# EAGLE design DIY-Arduino-v0.1 (EAGLE 9.2.0)
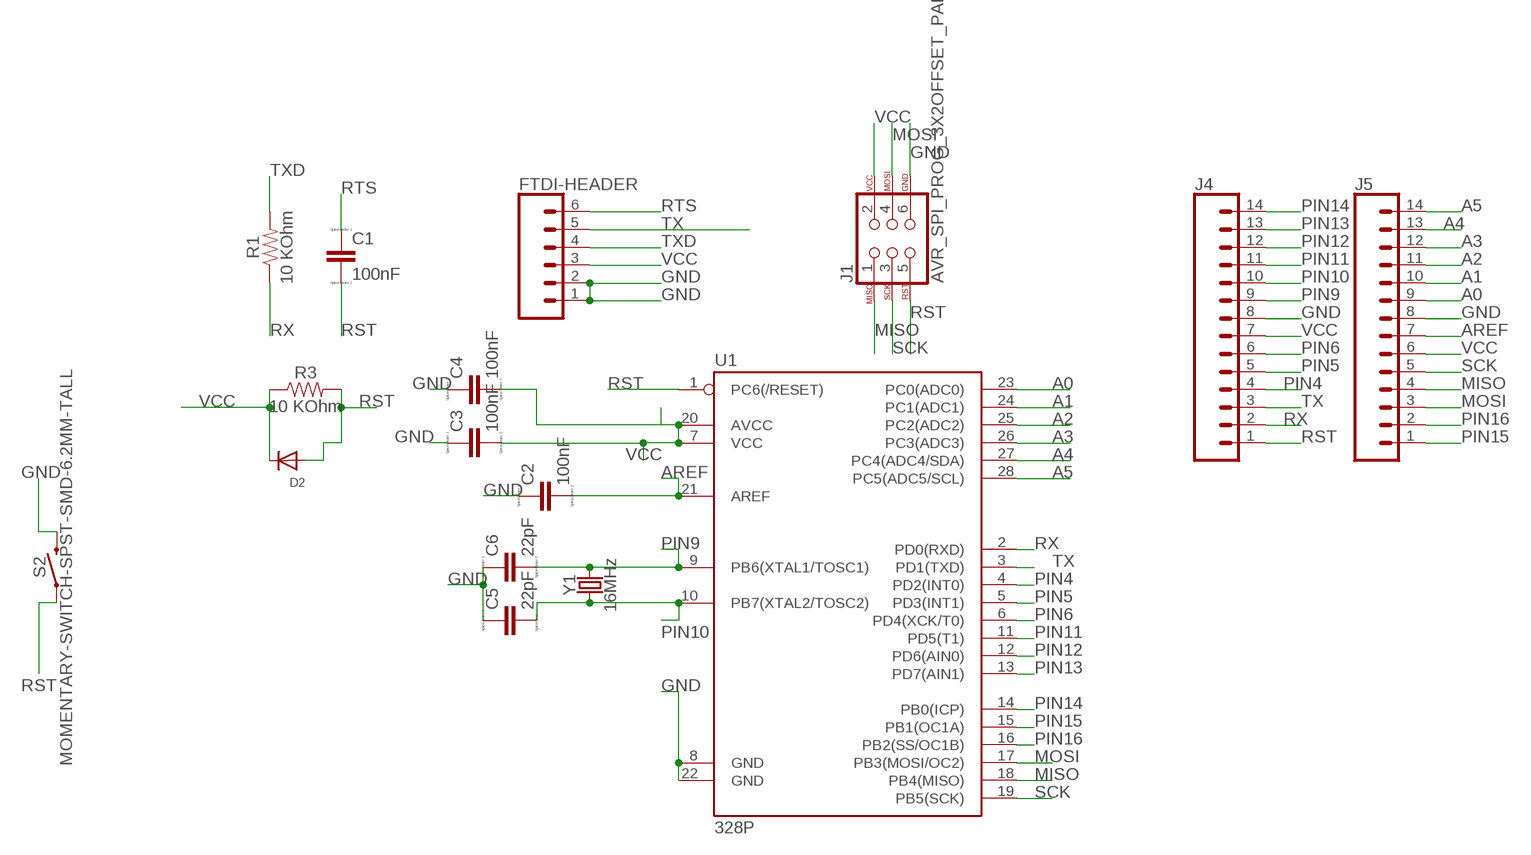
[diagram p0: schematic, sheet 1]

## Parts
C1  100nF  CC1206  [C1206]
C2  100nF  CC1206  [C1206]
C3  100nF  CC1206  [C1206]
C4  100nF  CC1206  [C1206]
C5  22pF  CC1206  [C1206]
C6  22pF  CC1206  [C1206]
D2  DIODEDO-1N4148  [DO-1N4148]
FTDI-HEADER  CONN_06NO_SILK_FEMALE_PTH  [1X06_NO_SILK]
J1  AVR_SPI_PROG_3X2OFFSET_PADS  [2X3_OFFSET]
J4  CONN_14NO_SILK  [1X14_NO_SILK]
J5  CONN_14NO_SILK  [1X14_NO_SILK]
R1  10 KOhm  RESISTOR1206  [1206]
R3  10 KOhm  RESISTOR1206  [1206]
S2  MOMENTARY-SWITCH-SPST-SMD-6.2MM-TALL  [TACTILE_SWITCH_SMD_6.2MM_TALL]
U1  328P  ATMEGA328P_PDIP  [DIP28]
Y1  16MHz  CRYSTAL-16MHZPTH-HC49US  [HC49US]

## Nets
A0: J5.9 U1.23(PC0(ADC0))
A1: J5.10 U1.24(PC1(ADC1))
A2: J5.11 U1.25(PC2(ADC2))
A3: J5.12 U1.26(PC3(ADC3))
A4: J5.13 U1.27(PC4(ADC4/SDA))
A5: J5.14 U1.28(PC5(ADC5/SCL))
AREF: C2.2 J5.7 U1.21(AREF)
GND: C2.1 C3.1 C4.1 C5.1 C6.1 FTDI-HEADER.1 FTDI-HEADER.2 J1.6 J4.8 J5.8 S2.B2 U1.8(GND) U1.22(GND)
MISO: J1.1 J5.4 U1.18(PB4(MISO))
MOSI: J1.4 J5.3 U1.17(PB3(MOSI/OC2))
PIN4: J4.4 U1.4(PD2(INT0))
PIN5: J4.5 U1.5(PD3(INT1))
PIN6: J4.6 U1.6(PD4(XCK/T0))
PIN9: C6.2 J4.9 U1.9(PB6(XTAL1/TOSC1)) Y1.2
PIN10: C5.2 J4.10 U1.10(PB7(XTAL2/TOSC2)) Y1.1
PIN11: J4.11 U1.11(PD5(T1))
PIN12: J4.12 U1.12(PD6(AIN0))
PIN13: J4.13 U1.13(PD7(AIN1))
PIN14: J4.14 U1.14(PB0(ICP))
PIN15: J5.1 U1.15(PB1(OC1A))
PIN16: J5.2 U1.16(PB2(SS/OC1B))
RST: C1.2 D2.A J1.5 J4.1 R3.2 S2.A2 U1.1(PC6(/RESET))
RTS: C1.1 FTDI-HEADER.6
RX: J4.2 R1.1 U1.2(PD0(RXD))
SCK: J1.3 J5.5 U1.19(PB5(SCK))
TX: FTDI-HEADER.5 J4.3 U1.3(PD1(TXD))
TXD: FTDI-HEADER.4 R1.2
VCC: C3.2 C4.2 D2.C FTDI-HEADER.3 J1.2 J4.7 J5.6 R3.1 U1.7(VCC) U1.20(AVCC)

## Library data of the parts
C1-C6 = eagle-ltspice:C: CAPACITOR, European symbol; SPICEMODEL: NONE; SPICEPREFIX: C
D2 = adafruit:DIODE: Diode SMADIODE - SMA Surface Mount Package 20V 1A Schottky Diode Digikey: 641-1014-6-ND DO-1N4148 - Through Hole Small Current Diode SOD-123 20V 1 A (.5mV Vf) Schottky Diode - Digikey: MBRX120TPMSCT-ND SOD-323 10V 570mA (.38mV Vf, 3ns) Schottky Diode - Digikey: ZLLS410CT-ND SOD-523 30V 30mA Schottky Diode (RB751S-40TE61) - Digikey: RB751S-40TE61CT-ND SOT23-R/W - SOT23 Package (R = Solder Paste/Reflow Ovens, W = Hand-Soldering) BAT54Film 40V 300mA - Digikey: 497-7162-1-ND
FTDI-HEADER = SparkFun-Connectors:CONN_06: Multi connection point. Often used as Generic Header-pin footprint for 0.1 inch spaced/style header connections On any of the 0.1 inch spaced packages, you can populate with these: Break Away Headers - Straight <https://www.sparkfun.com/products/116> (PRT-00116) Break Away Male Headers - Right Angle <https://www.sparkfun.com/products/553> (PRT-00553) Female Headers <https://www.sparkfun.com/products/115> (PRT-00115) Break Away Headers - Machine Pin <https://www.sparkfun.com/products/117> (PRT-00117) Break Away Female Headers - Swiss Machine Pin <https://www.sparkfun.com/products/743> (PRT-00743) Arduino Stackable Header - 6 Pin <https://www.sparkfun.com/products/9280> (PRT-09280) For SCREWTERMINALS and SPRING TERMINALS visit here: Screw Terimnals on SparkFun.com <https://www.sparkfun.com/search/results?term=Screw+Terminals> (5mm/3.5mm/2.54mm spacing) This device is also useful as a general connection point to wire up your design to another part of your project. Our various solder wires solder well into these plated through hole pads. Hook-Up Wire - Assortment (Stranded, 22 AWG) <https://www.sparkfun.com/products/11375> (PRT-11375) Hook-Up Wire - Assortment (Solid Core, 22 AWG) <https://www.sparkfun.com/products/11367> (PRT-11367) View the entire wire category on our website here <https://www.sparkfun.com/categories/141>; PROD_ID: CONN-08437
J1 = SparkFun-Connectors:AVR_SPI_PROG_3X2: AVR ISP 6 Pin This is the reduced ISP connector for AVR programming. Common on Arduino. This footprint will take up less PCB space and can be used with a 10-pin to 6-pin adapter such as SKU: BOB-08508 **Special note about "TEST_POINT" package. The stop mask is on the top side, so if you want your programming test points to be on the bottom of your board, make sure to place this package on the bottom side of the board. This also ensure that the orientation to program from the bottom side will be correct. SparkFun Products: SparkFun ISP Pogo Adapter <https://www.sparkfun.com/products/11591> - NS Tiny AVR Programmer <https://www.sparkfun.com/products/11801> -PTH
J4 J5 = SparkFun-Connectors:CONN_14: Multi connection point. Often used as Generic Header-pin footprint for 0.1 inch spaced/style header connections On any of the 0.1 inch spaced packages, you can populate with these: Break Away Headers - Straight <https://www.sparkfun.com/products/116> (PRT-00116) Break Away Male Headers - Right Angle <https://www.sparkfun.com/products/553> (PRT-00553) Female Headers <https://www.sparkfun.com/products/115> (PRT-00115) Break Away Headers - Machine Pin <https://www.sparkfun.com/products/117> (PRT-00117) Break Away Female Headers - Swiss Machine Pin <https://www.sparkfun.com/products/743> (PRT-00743) For SCREWTERMINALS and SPRING TERMINALS visit here: Screw Terimnals on SparkFun.com <https://www.sparkfun.com/search/results?term=Screw+Terminals> (5mm/3.5mm/2.54mm spacing) This device is also useful as a general connection point to wire up your design to another part of your project. Our various solder wires solder well into these plated through hole pads. Hook-Up Wire - Assortment (Stranded, 22 AWG) <https://www.sparkfun.com/products/11375> (PRT-11375) Hook-Up Wire - Assortment (Solid Core, 22 AWG) <https://www.sparkfun.com/products/11367> (PRT-11367) View the entire wire category on our website here <https://www.sparkfun.com/categories/141> Special notes: Molex polarized connector foot print use with SKU : PRT-08231 with associated crimp pins and housings. 1MM SMD Version SKU: PRT-10208 NOTES ON THE VARIANTS LOCK and LOCK_LONGPADS... This footprint was designed to help hold the alignment of a through-hole component (i.e. 6-pin header) while soldering it into place. You may notice that each hole has been shifted either up or down by 0.005 of an inch from it's more standard position (which is a perfectly straight line). This slight alteration caused the pins (the squares in the middle) to touch the edges of the holes. Because they are alternating, it causes a "brace" to hold the component in place. 0.005 has proven to be the perfect amount of "off-center" position when using our standard breakaway headers. Although looks a little odd when you look at the bare footprint, once you have a header in there, the alteration is very hard to notice. Also,if you push a header all the way into place, it is covered up entirely on the bottom side.
R1 R3 = SparkFun-Resistors:RESISTOR: Generic Resistor Package
S2 = SparkFun-Switches:MOMENTARY-SWITCH-SPST: Momentary Switch (Pushbutton) - SPST Normally-open (NO) SPST momentary switches (buttons, pushbuttons). Variants PTH-12MM - 12mm square, through-hole Momentary Pushbutton Switch - 12mm Square <https://www.sparkfun.com/products/9190> (COM-09190) PTH-6.0MM, PTH-6.0MM-KIT - 6.0mm square, through-hole Mini Pushbutton Switch <https://www.sparkfun.com/products/97> (COM-00097) KIT package intended for soldering kit's - only one side of pads' copper is exposed. PTH-RIGHT-ANGLE-KIT - Right-angle, through-hole Right Angle Tactile Button <https://www.sparkfun.com/products/10791> - Used on SparkFun BigTime Watch Kit <https://www.sparkfun.com/products/11734> SMD-12MM - 12mm square, surface-mount Tactile Button - SMD (12mm) <https://www.sparkfun.com/products/12993> (COM-12993) Used on SparkFun PicoBoard <https://www.sparkfun.com/products/11888> SMD-4.5MM - 4.5mm Square Trackball Switch Used on SparkFun Blackberry Trackballer Breakout <https://www.sparkfun.com/products/13169> SMD-4.6MMX2.8MM - 4.60mm x 2.80mm, surface mount Used on SparkFun SAMD21 Mini Breakout <https://www.sparkfun.com/products/13664> SMD-5.2MM, SMD-5.2-REDUNDANT - 5.2mm square, surface-mount Mini Pushbutton Switch - SMD <https://www.sparkfun.com/products/8720> (COM-08720) Used on Arduino Pro Mini <https://www.sparkfun.com/products/11114> REDUNDANT package connects both switch circuits together SMD-6.0X3.5MM - 6.0 x 3.5mm, surface mount Momentary Reset Switch SMD <https://www.sparkfun.com/products/8229> (COM-08229) SMD-6.2MM-TALL - 6.2mm square, surface mount Tactile Button - SMD (6mm) <https://www.sparkfun.com/products/12992> Used on SparkFun Digital Sandbox <https://www.sparkfun.com/products/12651> SMD-RIGHT-ANGLE - Right-angle, surface mount Used on SparkFun Block for Intel® Edison - Arduino <https://www.sparkfun.com/products/13036>; PROD_ID: SWCH-11966; SF_SKU: COM-12992
U1 = SparkFun-IC-Microcontroller:ATMEGA328P_PDIP: Atmel 328P Through hole ATMEGA328P uC used in the Arduino 32kb flash, 1k EEPROM, 2k SRAM Datasheet <http://www.sparkfun.com/datasheets/Components/SMD/ATMega328.pdf> SparkFun Products Storefront component: AVR 28 Pin 20MHz 32K 6A/D - ATMega328P <https://www.sparkfun.com/products/9061> (COM-09061) SparkFun Simon Says - Through-Hole Soldering Kit <https://www.sparkfun.com/products/10547> (KIT-10547) SparkFun Learn to Solder - Simon Says <https://www.sparkfun.com/products/13708> (KIT-13708) SparkFun BigTime Watch Kit <https://www.sparkfun.com/products/11734> (KIT-11734) SparkFun ClockIt <https://www.sparkfun.com/products/10930> (KIT-10930) SparkFun Serial Enabled LCD Kit <https://www.sparkfun.com/products/10097> (LCD-10097) SparkFun Simon Tilts - Through Hole Soldering Kit <https://www.sparkfun.com/products/12634> (KIT-12634) SparkFun Frequency Counter Kit <https://www.sparkfun.com/products/10140> (KIT-10140) FabFM Radio Kit <https://www.sparkfun.com/products/11043> (KIT-11043) SparkFun Binary Blaster Kit <https://www.sparkfun.com/products/12037> (KIT-12037) SparkFun Metro-Gnome <https://www.sparkfun.com/products/9236> (KIT-09236) ATmega328 with Arduino Optiboot (Uno) <https://www.sparkfun.com/products/10524> (DEV-10524); PROD_ID: IC-09136
Y1 = SparkFun-Clocks:CRYSTAL-16MHZ: 16MHz Crystal Digikey Example <http://www.digikey.com/product-search/en?keywords=535-9122-1-ND> Frequency: 16MHz Frequency Stability: ±50ppm Frequency Tolerance: ±20ppm Load Capacitance: 18pF SparkFun Products: Pro Micro -5V/16MHz <https://www.sparkfun.com/products/12640> SparkFun Serial Enabled LCD Kit <https://www.sparkfun.com/products/10097>; PROD_ID: XTAL-08181; SF_ID: COM-00536

## Board
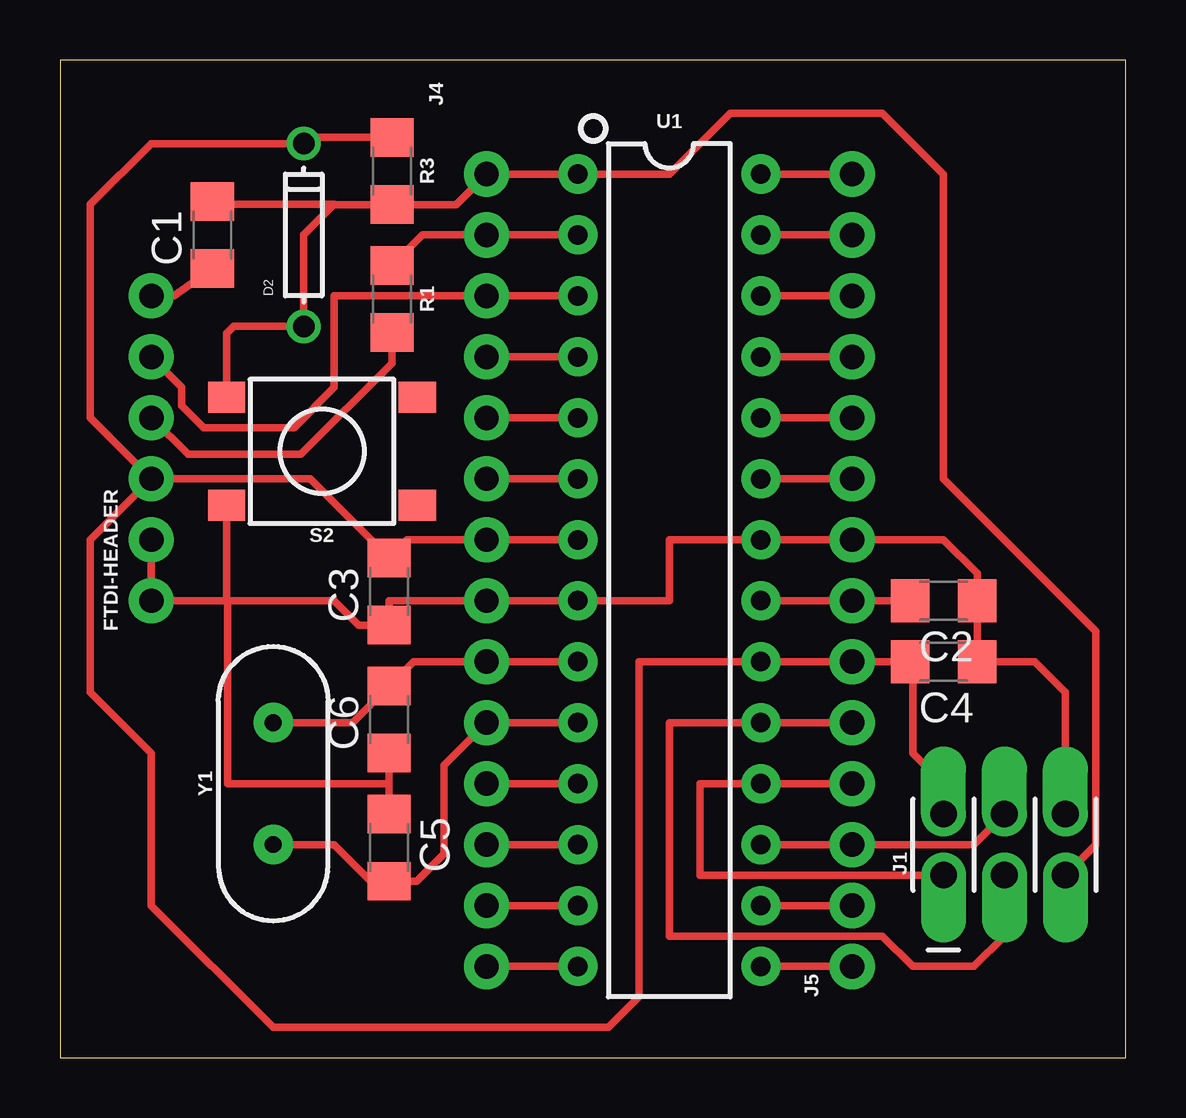
[diagram p1: board, top side]
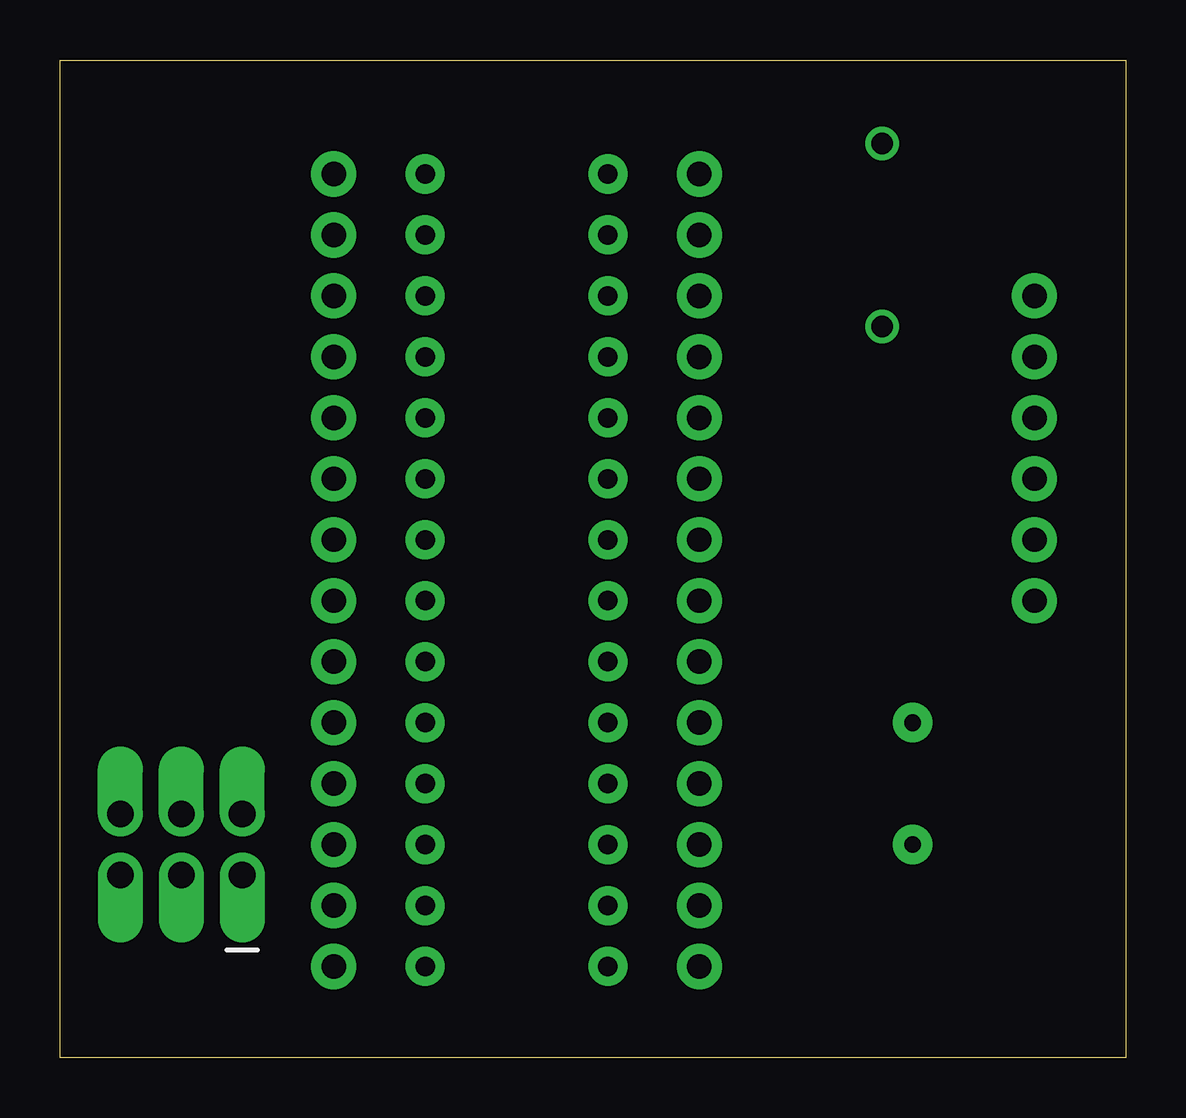
[diagram p2: board, bottom side, seen from below]

Size 44.43 x 41.58 mm. Coordinates in mm from the lower left corner, seen from the top.
Outline: 0,0 44.43,0 44.43,41.58 0,41.58 0,0
Copper layers (1*16): Top 0.035mm / dielectric 1.5mm / Bottom 0.035mm
Design rules "default": minimum track width 6mil, minimum drill 0.35mm, track to track 6mil, track to pad 6mil, pad to pad 6mil, via to via 6mil, smd to smd 6mil, copper to edge 40mil, drill to drill 6mil, minimum pad ring 10mil, minimum via ring 8mil, stop-mask expansion 4mil, vias tented up to drill 0mil, thermal gap 10mil

### Footprints (pad centres in the part's own frame; a part is rotated, then mirrored left to right if it is on the bottom)
C1206 = smd 1.6 x 1.8: 1 -1.4,0; 2 1.4,0
DO-1N4148 = drill 0.9: A -3.81,0; C 3.81,0
1X06_NO_SILK = drill 1.016 pad 1.88: 1 0,0; 2 2.54,0; 3 5.08,0; 4 7.62,0; 5 10.16,0; 6 12.7,0
2X3_OFFSET = drill 1.118 pad 1.88 offset: 1 -2.54,-1.27; 2 -2.54,1.27; 3 0,-1.27; 4 0,1.27; 5 2.54,-1.27; 6 2.54,1.27
1X14_NO_SILK = drill 1.016 pad 1.88: 1 0,0; 2 2.54,0; 3 5.08,0; 4 7.62,0; 5 10.16,0; 6 12.7,0; 7 15.24,0; 8 17.78,0; 9 20.32,0; 10 22.86,0; 11 25.4,0; 12 27.94,0; 13 30.48,0; 14 33.02,0
1206 = smd 1.6 x 1.8: 1 -1.4,0; 2 1.4,0
TACTILE_SWITCH_SMD_6.2MM_TALL = smd 1.55 x 1.3: A1 -3.975,-2.25; A2 3.975,-2.25; B1 -3.975,2.25; B2 3.975,2.25
DIP28 = drill 0.813 pad 1.626: 1 -16.51,-3.81; 2 -13.97,-3.81; 3 -11.43,-3.81; 4 -8.89,-3.81; 5 -6.35,-3.81; 6 -3.81,-3.81; 7 -1.27,-3.81; 8 1.27,-3.81; 9 3.81,-3.81; 10 6.35,-3.81; 11 8.89,-3.81; 12 11.43,-3.81; 13 13.97,-3.81; 14 16.51,-3.81; 15 16.51,3.81; 16 13.97,3.81; 17 11.43,3.81; 18 8.89,3.81; 19 6.35,3.81; 20 3.81,3.81; 21 1.27,3.81; 22 -1.27,3.81; 23 -3.81,3.81; 24 -6.35,3.81; 25 -8.89,3.81; 26 -11.43,3.81; 27 -13.97,3.81; 28 -16.51,3.81
HC49US = drill 0.7 pad 1.651: 1 -2.54,0; 2 2.54,0

### Placement (x,y rotation side)
C1  6.35,34.29 90 top
C2  36.83,19.05 180 top
C3  13.72,19.43 90 top
C4  36.83,16.51 180 top
C5  13.72,8.76 270 top
C6  13.72,14.1 90 top
D2  10.16,34.29 90 top
FTDI-HEADER  3.81,19.05 90 top
J1  39.37,8.89 0 top
J4  17.78,36.83 270 top
J5  33.02,3.81 90 top
R1  13.84,31.62 270 top
R3  13.84,36.96 270 top
S2  10.92,25.27 180 top
U1  25.4,20.32 270 top
Y1  8.89,11.43 90 top

### Tracks (layer width: path | path; a pad name or v marks a point on that pad's centre or on a via)
A0
  Top 0.305: J5.9 U1.23
A1
  Top 0.305: J5.10 U1.24
A2
  Top 0.305: J5.11 U1.25
A3
  Top 0.305: J5.12 U1.26
A4
  Top 0.305: J5.13 U1.27
A5
  Top 0.305: J5.14 U1.28
AREF
  Top 0.305: U1.21 J5.7 C2.2
GND
  Top 0.305: C6.1 13.72,11.43 | 13.72,11.43 C5.1 | 6.73,23.24 S2.B2 6.95,19.05 | 6.99,19.05 11.43,19.05 12.45,18.03 C3.1 13.72,19.05 J4.8 U1.8 25.4,19.05 25.4,21.59 U1.22 J5.8 36.83,21.59 38.23,20.19 C2.1 C4.1 40.64,16.51 41.91,15.24 J1.6 | 6.99,19.05 6.95,19.05 | 6.95,19.05 FTDI-HEADER.1 FTDI-HEADER.2 | 13.72,11.43 6.99,11.43 6.99,19.05
MISO
  Top 0.305: J5.4 U1.18 26.67,11.43 26.67,7.62 J1.1
MOSI
  Top 0.305: U1.17 J5.3 38.1,8.89 J1.4
PIN4
  Top 0.305: U1.4 J4.4
PIN5
  Top 0.305: U1.5 J4.5
PIN6
  Top 0.305: U1.6 J4.6
PIN9
  Top 0.305: Y1.2 12.19,13.97 C6.2 14.73,16.51 J4.9 U1.9
PIN10
  Top 0.305: Y1.1 11.43,8.89 12.96,7.36 C5.2 | C5.2 | U1.10 J4.10 16,12.19 16,8.51 14.86,7.36 C5.2
PIN11
  Top 0.305: U1.11 J4.11
PIN12
  Top 0.305: U1.12 J4.12
PIN13
  Top 0.305: U1.13 J4.13
PIN14
  Top 0.305: U1.14 J4.14
PIN15
  Top 0.305: J5.1 U1.15
PIN16
  Top 0.305: J5.2 U1.16
RST
  Top 0.305: U1.1 | U1.1 J4.1 16.51,35.56 R3.2 11.43,35.56 | U1.1 25.4,36.83 27.94,39.37 34.29,39.37 36.83,36.83 36.83,24.13 43.18,17.78 43.18,8.89 J1.5 | 11.43,35.56 10.16,34.29 D2.A 7.24,30.48 6.95,30.19 S2.A2 | 11.43,35.56 6.48,35.56 C1.2
RTS
  Top 0.305: C1.1 4.77,31.75 FTDI-HEADER.6
RX
  Top 0.305: R1.1 15.11,34.29 J4.2 U1.2
SCK
  Top 0.305: J5.5 U1.19 25.4,13.97 25.4,5.08 34.29,5.08 35.56,3.81 38.1,3.81 39.37,5.08 J1.3
TX
  Top 0.305: U1.3 J4.3 11.43,31.75 11.43,27.94 9.75,26.26 6,26.26 5.08,27.18 5.08,27.94 FTDI-HEADER.5
TXD
  Top 0.305: R1.2 13.84,28.95 10.04,25.15 5.33,25.15 FTDI-HEADER.4
VCC
  Top 0.305: U1.7 J4.7 14.47,21.59 C3.2 10.42,24.13 FTDI-HEADER.3 | R3.1 10.42,38.36 D2.C 3.81,38.1 1.27,35.56 1.27,26.67 FTDI-HEADER.3 | FTDI-HEADER.3 1.27,21.59 1.27,15.24 3.81,12.7 3.81,6.35 8.89,1.27 22.86,1.27 24.13,2.54 24.13,16.51 U1.20 J5.6 C4.2 35.56,16.38 35.56,12.7 36.83,11.43 J1.2